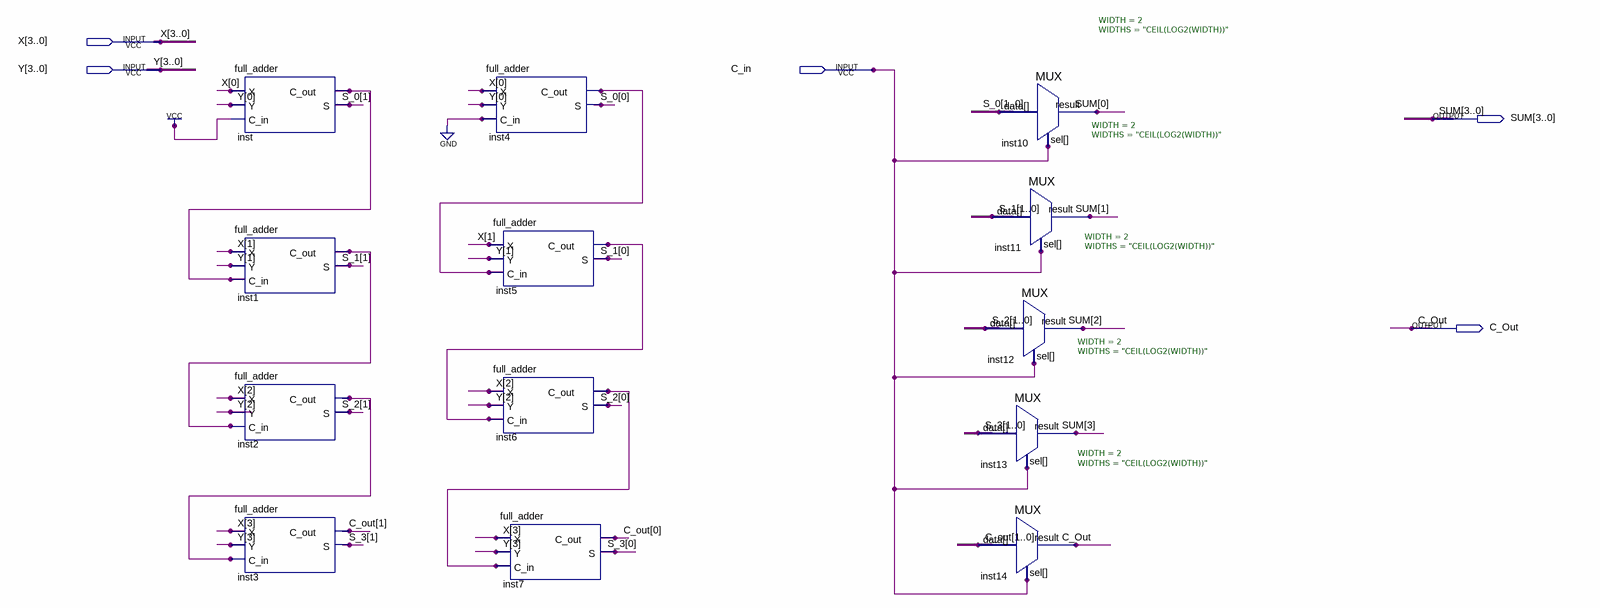
[diagram p0: schematic sheet]
// Quartus schematic carry_select_unit4.bdf as structural Verilog: 13 symbols, 5 pins
module carry_select_unit4 (
  input  [3:0] X,
  input  [3:0] Y,
  input  C_in,
  output [3:0] SUM,
  output C_Out
);

  wire inst1_c_out, inst2_c_out, inst4_c_out, inst5_c_out, inst6_c_out, inst_c_out;
  wire [1:0] C_Out_bus, S_0, S_1, S_2, S_3;

  full_adder inst (.X(X[0]), .Y(Y[0]), .C_in(1'b1), .C_out(inst_c_out), .S(S_0[1]));
  full_adder inst1 (.X(X[1]), .Y(Y[1]), .C_in(inst_c_out), .C_out(inst1_c_out), .S(S_1[1]));
  full_adder inst2 (.X(X[2]), .Y(Y[2]), .C_in(inst1_c_out), .C_out(inst2_c_out), .S(S_2[1]));
  full_adder inst3 (.X(X[3]), .Y(Y[3]), .C_in(inst2_c_out), .C_out(C_Out_bus[1]), .S(S_3[1]));
  full_adder inst4 (.X(X[0]), .Y(Y[0]), .C_in(1'b0), .C_out(inst4_c_out), .S(S_0[0]));
  full_adder inst5 (.X(X[1]), .Y(Y[1]), .C_in(inst4_c_out), .C_out(inst5_c_out), .S(S_1[0]));
  full_adder inst6 (.X(X[2]), .Y(Y[2]), .C_in(inst5_c_out), .C_out(inst6_c_out), .S(S_2[0]));
  full_adder inst7 (.X(X[3]), .Y(Y[3]), .C_in(inst6_c_out), .C_out(C_Out_bus[0]), .S(S_3[0]));
  MUX #(.WIDTH(2), .WIDTHS("CEIL(LOG2(WIDTH))")) inst12 (.data(S_2), .sel(C_in), .result(SUM[2]));
  MUX #(.WIDTH(2), .WIDTHS("CEIL(LOG2(WIDTH))")) inst13 (.data(S_3), .sel(C_in), .result(SUM[3]));
  MUX #(.WIDTH(2), .WIDTHS("CEIL(LOG2(WIDTH))")) inst14 (.data(C_Out_bus), .sel(C_in), .result(C_Out));
  MUX #(.WIDTH(2), .WIDTHS("CEIL(LOG2(WIDTH))")) inst10 (.data(S_0), .sel(C_in), .result(SUM[0]));
  MUX #(.WIDTH(2), .WIDTHS("CEIL(LOG2(WIDTH))")) inst11 (.data(S_1), .sel(C_in), .result(SUM[1]));
endmodule
